# Altium project NBP12 Xilinx Spartan-IIE BGA456 Rev1.00.PrjPcb
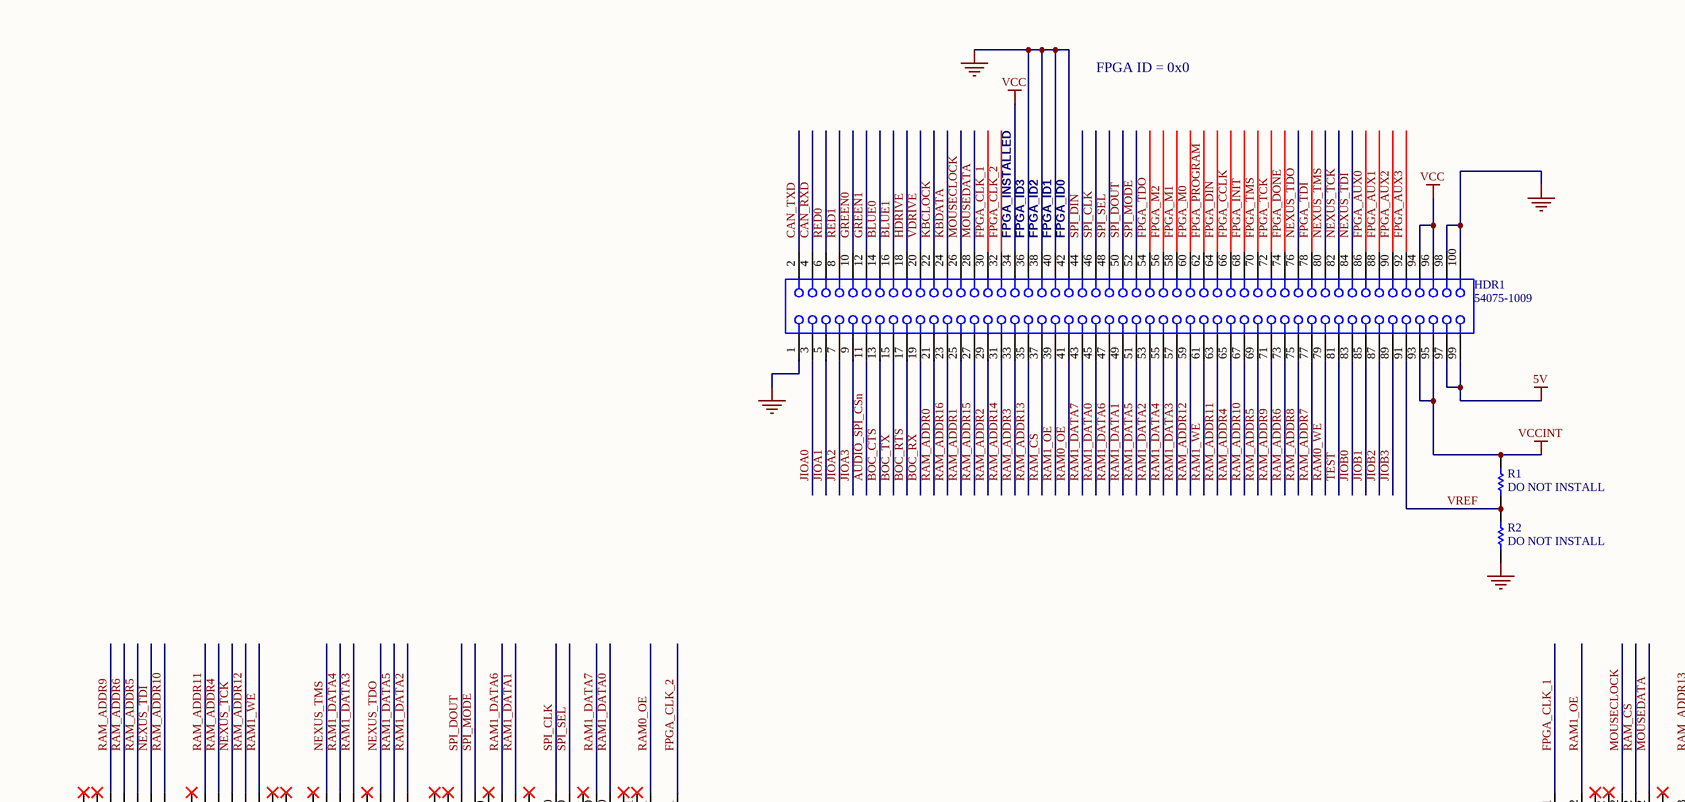
[diagram p0: NBP12 Xilinx Spartan-IIE BGA456 Rev1.00.SchDoc, top left]
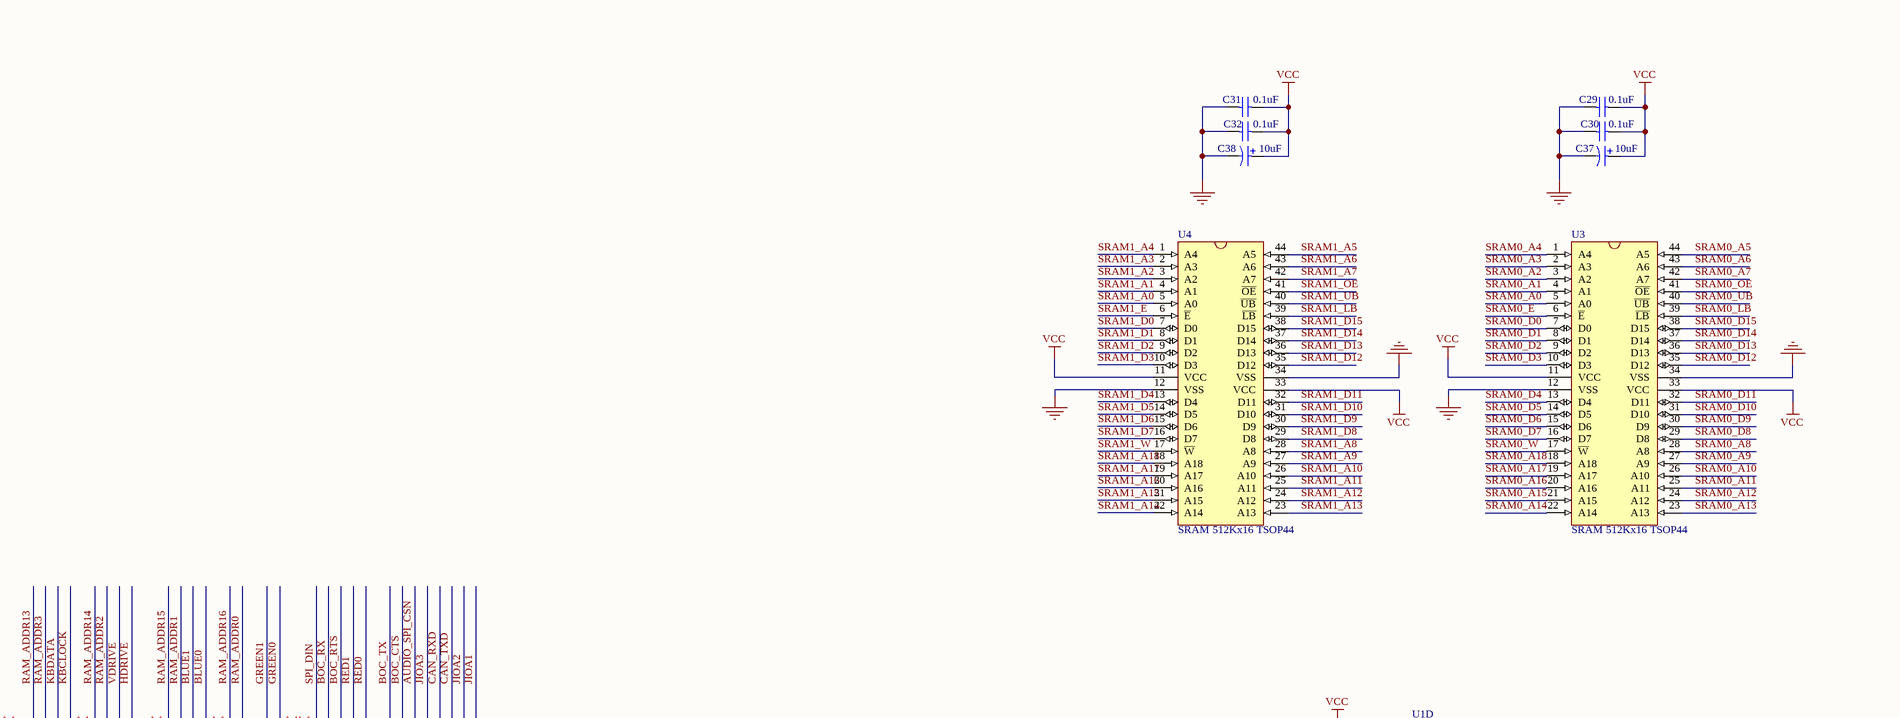
[diagram p1: NBP12 Xilinx Spartan-IIE BGA456 Rev1.00.SchDoc, top right]
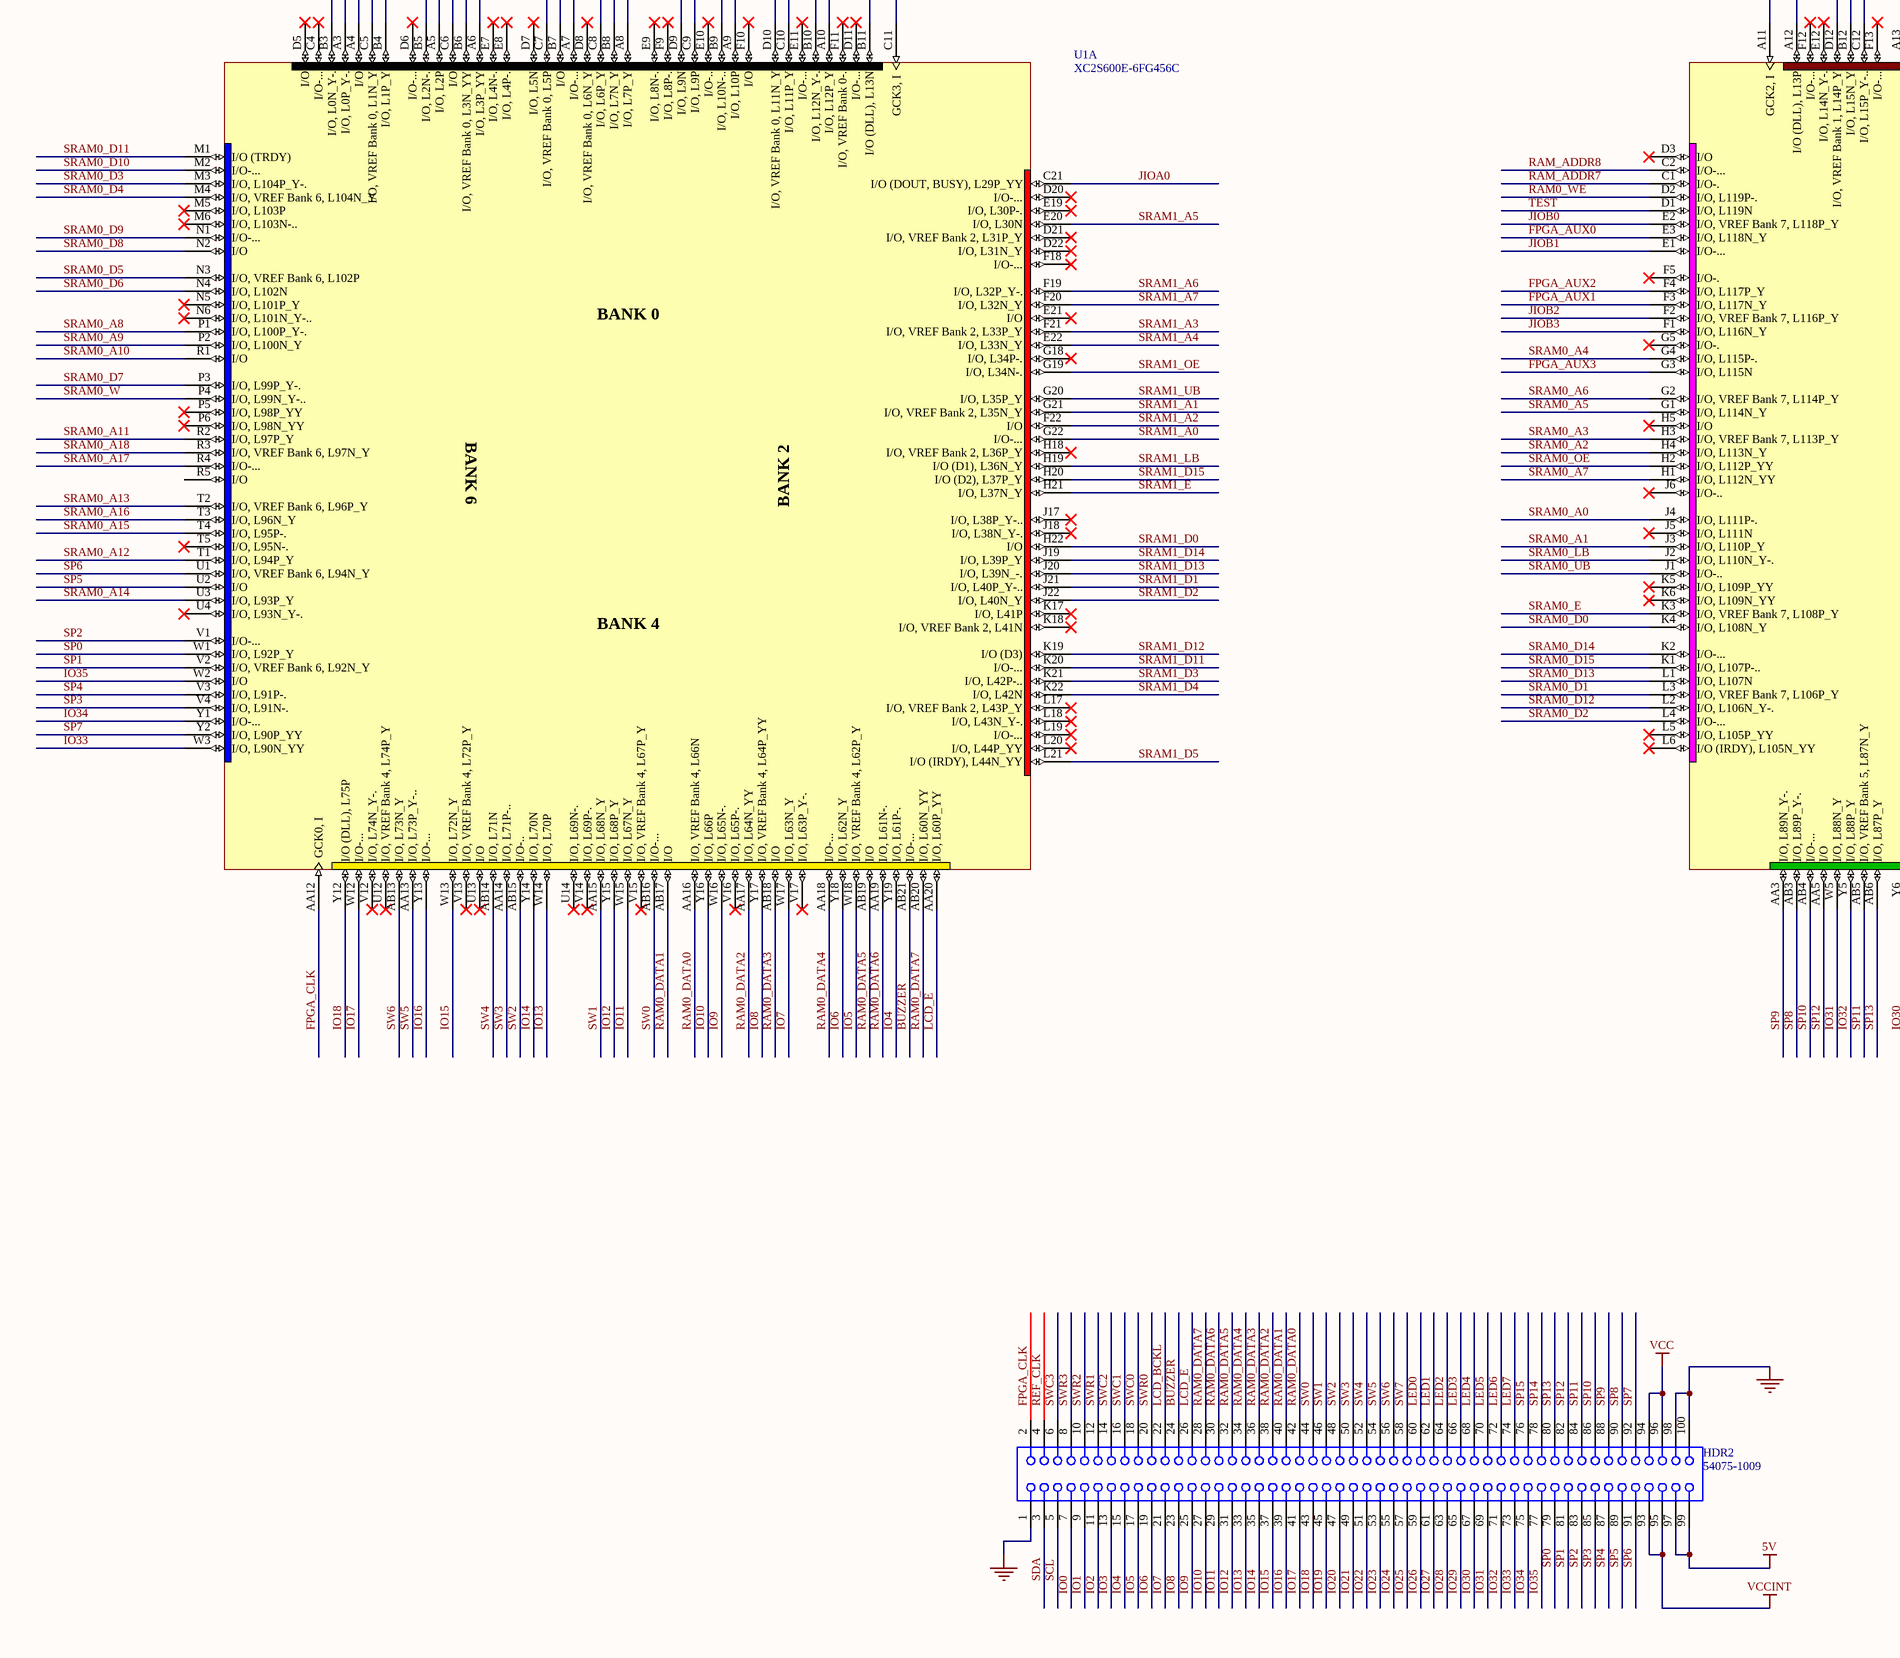
[diagram p2: NBP12 Xilinx Spartan-IIE BGA456 Rev1.00.SchDoc, bottom left]
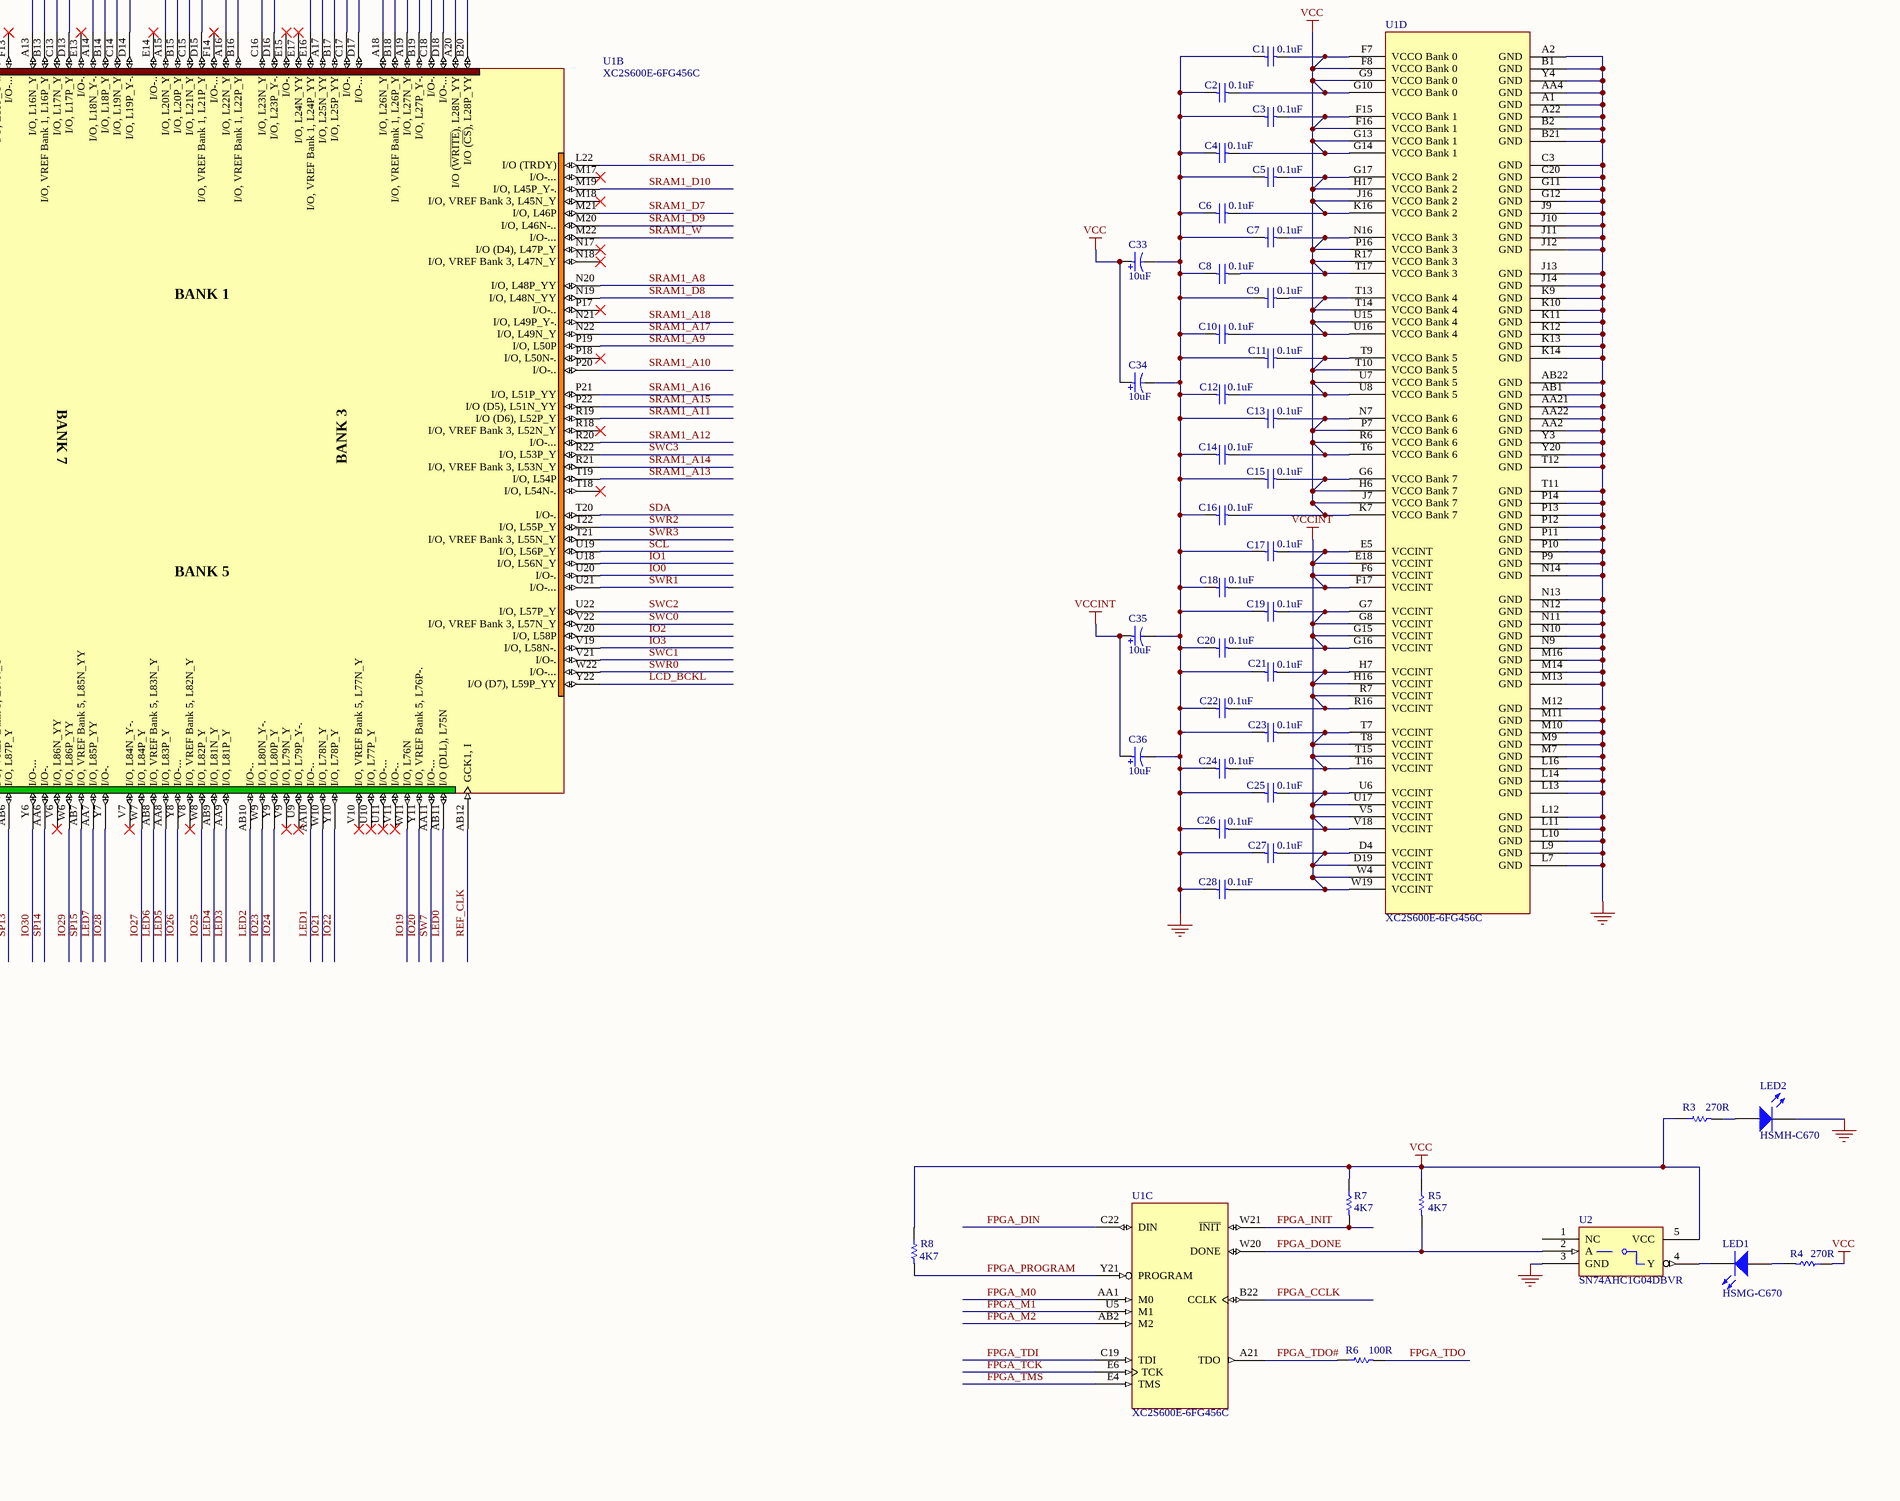
[diagram p3: NBP12 Xilinx Spartan-IIE BGA456 Rev1.00.SchDoc, bottom right]
1 sheet, 54 parts. Net scope: global (net labels, ports and power ports of the same name join across sheets).
Board file: NBP12 Xilinx Spartan-IIE BGA456 Rev1.00.PcbDoc

## Sheet NBP12 Xilinx Spartan-IIE BGA456 Rev1.00.SchDoc
size D; Organization: Altium Limited; Address1: L3, 12a Rodborough Rd; Address2: Frenchs Forest; Address3: NSW; Address4: Australia 2086; DocumentNumber: 1; SheetNumber: 1; SheetTotal: 1

### Parts
C1  0.1uF  [CC1608-0603]
C2  0.1uF  [CC1608-0603]
C3  0.1uF  [CC1608-0603]
C4  0.1uF  [CC1608-0603]
C5  0.1uF  [CC1608-0603]
C6  0.1uF  [CC1608-0603]
C7  0.1uF  [CC1608-0603]
C8  0.1uF  [CC1608-0603]
C9  0.1uF  [CC1608-0603]
C10  0.1uF  [CC1608-0603]
C11  0.1uF  [CC1608-0603]
C12  0.1uF  [CC1608-0603]
C13  0.1uF  [CC1608-0603]
C14  0.1uF  [CC1608-0603]
C15  0.1uF  [CC1608-0603]
C16  0.1uF  [CC1608-0603]
C17  0.1uF  [CC1608-0603]
C18  0.1uF  [CC1608-0603]
C19  0.1uF  [CC1608-0603]
C20  0.1uF  [CC1608-0603]
C21  0.1uF  [CC1608-0603]
C22  0.1uF  [CC1608-0603]
C23  0.1uF  [CC1608-0603]
C24  0.1uF  [CC1608-0603]
C25  0.1uF  [CC1608-0603]
C26  0.1uF  [CC1608-0603]
C27  0.1uF  [CC1608-0603]
C28  0.1uF  [CC1608-0603]
C29  0.1uF  [CC1608-0603]
C30  0.1uF  [CC1608-0603]
C31  0.1uF  [CC1608-0603]
C32  0.1uF  [CC1608-0603]
C33  10uF  [MCCT-B]
C34  10uF  [MCCT-B]
C35  10uF  [MCCT-B]
C36  10uF  [MCCT-B]
C37  10uF  [MCCT-B]
C38  10uF  [MCCT-B]
HDR1  54075-1009  [54075]
HDR2  54075-1009  [54075]
LED1  HSMG-C670  [SMD _LED]
LED2  HSMH-C670  [SMD _LED]
R1  DO NOT INSTALL  [CC2012-0805]
R2  DO NOT INSTALL  [CC2012-0805]
R3  270R  [CC2012-0805]
R4  270R  [CC2012-0805]
R5  4K7  [CC2012-0805]
R6  100R  [CC2012-0805]
R7  4K7  [CC2012-0805]
R8  4K7  [CC2012-0805]
U1  XC2S600E-6FG456C  [FG456]  (parts A,B,C,D of 4)
U2  SN74AHC1G04DBVR  [SO-G5/P.95]
U3  SRAM 512Kx16 TSOP44  [SO-G44/P.8]
U4  SRAM 512Kx16 TSOP44  [SO-G44/P.8]

### Nets
5V: HDR1.97 HDR1.99 HDR2.97 HDR2.99
GND: C1.1 C2.1 C3.1 C4.1 C5.1 C6.1 C7.1 C8.1 C9.1 C10.1 C11.1 C12.1 C13.1 C14.1 C15.1 C16.1 C17.1 C18.1 C19.1 C20.1 C21.1 C22.1 C23.1 C24.1 C25.1 C26.1 C27.1 C28.1 C29.1 C30.1 C31.1 C32.1 C33.2 C34.2 C35.2 C36.2 C37.2 C38.2 HDR1.1 HDR1.36 HDR1.38 HDR1.40 HDR1.42 HDR1.98 HDR1.100 HDR2.1 HDR2.98 HDR2.100 LED2.2(K) R2.2 U1.A1(GND) U1.A2(GND) U1.A22(GND) U1.AA2(GND) U1.AA4(GND) U1.AA21(GND) U1.AA22(GND) U1.AB1(GND) U1.AB22(GND) U1.B1(GND) U1.B2(GND) U1.B21(GND) U1.C3(GND) U1.C20(GND) U1.G11(GND) U1.G12(GND) U1.J9(GND) U1.J10(GND) U1.J11(GND) U1.J12(GND) U1.J13(GND) U1.J14(GND) U1.K9(GND) U1.K10(GND) U1.K11(GND) U1.K12(GND) U1.K13(GND) U1.K14(GND) U1.L7(GND) U1.L9(GND) U1.L10(GND) U1.L11(GND) U1.L12(GND) U1.L13(GND) U1.L14(GND) U1.L16(GND) U1.M7(GND) U1.M9(GND) U1.M10(GND) U1.M11(GND) U1.M12(GND) U1.M13(GND) U1.M14(GND) U1.M16(GND) U1.N9(GND) U1.N10(GND) U1.N11(GND) U1.N12(GND) U1.N13(GND) U1.N14(GND) U1.P9(GND) U1.P10(GND) U1.P11(GND) U1.P12(GND) U1.P13(GND) U1.P14(GND) U1.T11(GND) U1.T12(GND) U1.Y3(GND) U1.Y4(GND) U1.Y20(GND) U2.3(GND) U3.12(VSS) U3.34(VSS) U4.12(VSS) U4.34(VSS)
VCC: C1.2 C2.2 C3.2 C4.2 C5.2 C6.2 C7.2 C8.2 C9.2 C10.2 C11.2 C12.2 C13.2 C14.2 C15.2 C16.2 C29.2 C30.2 C31.2 C32.2 C33.1 C34.1 C37.1 C38.1 HDR1.34 HDR1.94 HDR1.96 HDR2.94 HDR2.96 R3.1 R4.1 R5.1 R7.1 R8.1 U1.F7(VCCO_Bank_0) U1.F8(VCCO_Bank_0) U1.F15(VCCO_Bank_1) U1.F16(VCCO_Bank_1) U1.G6(VCCO_Bank_7) U1.G9(VCCO_Bank_0) U1.G10(VCCO_Bank_0) U1.G13(VCCO_Bank_1) U1.G14(VCCO_Bank_1) U1.G17(VCCO_Bank_2) U1.H6(VCCO_Bank_7) U1.H17(VCCO_Bank_2) U1.J7(VCCO_Bank_7) U1.J16(VCCO_Bank_2) U1.K7(VCCO_Bank_7) U1.K16(VCCO_Bank_2) U1.N7(VCCO_Bank_6) U1.N16(VCCO_Bank_3) U1.P7(VCCO_Bank_6) U1.P16(VCCO_Bank_3) U1.R6(VCCO_Bank_6) U1.R17(VCCO_Bank_3) U1.T6(VCCO_Bank_6) U1.T9(VCCO_Bank_5) U1.T10(VCCO_Bank_5) U1.T13(VCCO_Bank_4) U1.T14(VCCO_Bank_4) U1.T17(VCCO_Bank_3) U1.U7(VCCO_Bank_5) U1.U8(VCCO_Bank_5) U1.U15(VCCO_Bank_4) U1.U16(VCCO_Bank_4) U2.5(VCC) U3.11(VCC) U3.33(VCC) U4.11(VCC) U4.33(VCC)
VCCINT: C17.2 C18.2 C19.2 C20.2 C21.2 C22.2 C23.2 C24.2 C25.2 C26.2 C27.2 C28.2 C35.1 C36.1 HDR1.93 HDR1.95 HDR2.93 HDR2.95 R1.1 U1.D4(VCCINT) U1.D19(VCCINT) U1.E5(VCCINT) U1.E18(VCCINT) U1.F6(VCCINT) U1.F17(VCCINT) U1.G7(VCCINT) U1.G8(VCCINT) U1.G15(VCCINT) U1.G16(VCCINT) U1.H7(VCCINT) U1.H16(VCCINT) U1.R7(VCCINT) U1.R16(VCCINT) U1.T7(VCCINT) U1.T8(VCCINT) U1.T15(VCCINT) U1.T16(VCCINT) U1.U6(VCCINT) U1.U17(VCCINT) U1.V5(VCCINT) U1.V18(VCCINT) U1.W4(VCCINT) U1.W19(VCCINT)
AUDIO_SPI_CSn: HDR1.11 U1.A19(I/O,_L27N_Y)
BLUE0: HDR1.14 U1.D15(I/O,_VREF_Bank_1,_L21P_Y)
BLUE1: HDR1.16 U1.C15(I/O,_L21N_Y)
BOC_CTS: HDR1.13 U1.B18(I/O,_VREF_Bank_1,_L26P_Y)
BOC_RTS: HDR1.17 U1.B17(I/O,_L25P_YY)
BOC_RX: HDR1.19 U1.A17(I/O,_L25N_YY)
BOC_TX: HDR1.15 U1.A18(I/O,_L26N_Y)
BUZZER: HDR2.24 U1.AB21(I/O-...)
CAN_RXD: HDR1.4 U1.C18(I/O-.)
CAN_TXD: HDR1.2 U1.D18(I/O-...)
FPGA_AUX0: HDR1.86 U1.E3(I/O,_L118N_Y)
FPGA_AUX1: HDR1.88 U1.F3(I/O,_L117N_Y)
FPGA_AUX2: HDR1.90 U1.F4(I/O,_L117P_Y)
FPGA_AUX3: HDR1.92 U1.G3(I/O,_L115N)
FPGA_CCLK: HDR1.66 U1.B22(CCLK)
FPGA_CLK: HDR2.2 U1.AA12(GCK0,_I)
FPGA_CLK_1: HDR1.30 U1.A11(GCK2,_I)
FPGA_CLK_2: HDR1.32 U1.C11(GCK3,_I)
FPGA_DIN: HDR1.64 U1.C22(DIN)
FPGA_DONE: HDR1.74 R5.2 U1.W20(DONE) U2.2(A)
FPGA_INIT: HDR1.68 R7.2 U1.W21(~{INIT})
FPGA_M0: HDR1.60 U1.AA1(M0)
FPGA_M1: HDR1.58 U1.U5(M1)
FPGA_M2: HDR1.56 U1.AB2(M2)
FPGA_PROGRAM: HDR1.62 R8.2 U1.Y21(PROGRAM)
FPGA_TCK: HDR1.72 U1.E6(TCK)
FPGA_TDI: HDR1.78 U1.C19(TDI)
FPGA_TDO: HDR1.54 R6.2
FPGA_TDO#: R6.1 U1.A21(TDO)
FPGA_TMS: HDR1.70 U1.E4(TMS)
GREEN0: HDR1.10 U1.D16(I/O,_L23P_Y-.)
GREEN1: HDR1.12 U1.C16(I/O,_L23N_Y)
HDRIVE: HDR1.18 U1.D14(I/O,_L19P_Y-.)
IO0: HDR2.7 U1.U20(I/O-.)
IO1: HDR2.9 U1.U18(I/O,_L56N_Y)
IO2: HDR2.11 U1.V20(I/O,_L58P)
IO3: HDR2.13 U1.V19(I/O,_L58N-.)
IO4: HDR2.15 U1.Y19(I/O,_L61P-.)
IO5: HDR2.17 U1.W18(I/O,_VREF_Bank_4,_L62P_Y)
IO6: HDR2.19 U1.Y18(I/O,_L62N_Y)
IO7: HDR2.21 U1.W17(I/O,_L63N_Y)
IO8: HDR2.23 U1.Y17(I/O,_VREF_Bank_4,_L64P_YY)
IO9: HDR2.25 U1.W16(I/O,_L65N-.)
IO10: HDR2.27 U1.Y16(I/O,_L66P)
IO11: HDR2.29 U1.W15(I/O,_L67N_Y)
IO12: HDR2.31 U1.Y15(I/O,_L68P_Y)
IO13: HDR2.33 U1.W14(I/O,_L70P)
IO14: HDR2.35 U1.Y14(I/O,_L70N)
IO15: HDR2.37 U1.W13(I/O,_L72N_Y)
IO16: HDR2.39 U1.Y13(I/O-...)
IO17: HDR2.41 U1.W12(I/O-...)
IO18: HDR2.43 U1.Y12(I/O_(DLL),_L75P)
IO19: HDR2.45 U1.W11(I/O,_L76N)
IO20: HDR2.47 U1.Y11(I/O,_VREF_Bank_5,_L76P-.)
IO21: HDR2.49 U1.W10(I/O,_L78N_Y)
IO22: HDR2.51 U1.Y10(I/O,_L78P_Y)
IO23: HDR2.53 U1.W9(I/O,_L80N_Y-.)
IO24: HDR2.55 U1.Y9(I/O,_L80P_Y)
IO25: HDR2.57 U1.W8(I/O,_L82P_Y)
IO26: HDR2.59 U1.Y8(I/O-...)
IO27: HDR2.61 U1.W7(I/O,_L84P_Y)
IO28: HDR2.63 U1.Y7(I/O-.)
IO29: HDR2.65 U1.W6(I/O,_L86P_YY)
IO30: HDR2.67 U1.Y6(I/O-...)
IO31: HDR2.69 U1.W5(I/O,_L88N_Y)
IO32: HDR2.71 U1.Y5(I/O,_L88P_Y)
IO33: HDR2.73 U1.W3(I/O,_L90N_YY)
IO34: HDR2.75 U1.Y1(I/O-...)
IO35: HDR2.77 U1.W2(I/O)
JIOA0: HDR1.3 U1.C21(I/O_(DOUT,_BUSY),_L29P_YY)
JIOA1: HDR1.5 U1.B20(I/O_(~{CS}),_L28P_YY)
JIOA2: HDR1.7 U1.A20(I/O_(~{WRITE}),_L28N_YY)
JIOA3: HDR1.9 U1.B19(I/O,_L27P_Y-.)
JIOB0: HDR1.83 U1.E2(I/O,_VREF_Bank_7,_L118P_Y)
JIOB1: HDR1.85 U1.E1(I/O-...)
JIOB2: HDR1.87 U1.F2(I/O,_VREF_Bank_7,_L116P_Y)
JIOB3: HDR1.89 U1.F1(I/O,_L116N_Y)
KBCLOCK: HDR1.22 U1.D13(I/O,_L17P_Y)
KBDATA: HDR1.24 U1.C13(I/O,_L17N_Y)
LCD_BCKL: HDR2.22 U1.Y22(I/O_(D7),_L59P_YY)
LCD_E: HDR2.26 U1.AA20(I/O,_L60P_YY)
LED0: HDR2.60 U1.AB11(I/O_(DLL),_L75N)
LED1: HDR2.62 U1.AA10(I/O-..)
LED2: HDR2.64 U1.AB10(I/O-..)
LED3: HDR2.66 U1.AA9(I/O,_L81P_Y)
LED4: HDR2.68 U1.AB9(I/O,_L81N_Y)
LED5: HDR2.70 U1.AA8(I/O,_L83P_Y)
LED6: HDR2.72 U1.AB8(I/O,_VREF_Bank_5,_L83N_Y)
LED7: HDR2.74 U1.AA7(I/O,_L85P_YY)
MOUSECLOCK: HDR1.26 U1.D12(I/O,_VREF_Bank_1,_L14P_Y)
MOUSEDATA: HDR1.28 U1.C12(I/O,_L15P_Y-..)
NEXUS_TCK: HDR1.82 U1.C6(I/O)
NEXUS_TDI: HDR1.84 U1.C5(I/O,_VREF_Bank_0,_L1N_Y)
NEXUS_TDO: HDR1.76 U1.C8(I/O,_L6P_Y)
NEXUS_TMS: HDR1.80 U1.C7(I/O,_VREF_Bank_0,_L5P)
RAM0_DATA0: HDR2.42 U1.AA16(I/O,_VREF_Bank_4,_L66N)
RAM0_DATA1: HDR2.40 U1.AB17(I/O)
RAM0_DATA2: HDR2.38 U1.AA17(I/O,_L64N_YY)
RAM0_DATA3: HDR2.36 U1.AB18(I/O)
RAM0_DATA4: HDR2.34 U1.AA18(I/O-...)
RAM0_DATA5: HDR2.32 U1.AB19(I/O)
RAM0_DATA6: HDR2.30 U1.AA19(I/O,_L61N-.)
RAM0_DATA7: HDR2.28 U1.AB20(I/O,_L60N_YY)
RAM0_OE: HDR1.41 U1.B11(I/O_(DLL),_L13N)
RAM0_WE: HDR1.79 U1.D2(I/O,_L119P-.)
RAM1_DATA0: HDR1.45 U1.A10(I/O,_L12P_Y)
RAM1_DATA1: HDR1.49 U1.A9(I/O,_L10P)
RAM1_DATA2: HDR1.53 U1.A8(I/O,_L7P_Y)
RAM1_DATA3: HDR1.57 U1.A7(I/O-...)
RAM1_DATA4: HDR1.55 U1.B7(I/O)
RAM1_DATA5: HDR1.51 U1.B8(I/O,_L7N_Y)
RAM1_DATA6: HDR1.47 U1.B9(I/O,_L10N-..)
RAM1_DATA7: HDR1.43 U1.B10(I/O,_L12N_Y-.)
RAM1_OE: HDR1.39 U1.A12(I/O_(DLL),_L13P)
RAM1_WE: HDR1.61 U1.A6(I/O,_L3P_YY)
RAM_ADDR0: HDR1.21 U1.B16(I/O,_VREF_Bank_1,_L22P_Y)
RAM_ADDR1: HDR1.25 U1.B15(I/O,_L20P_Y)
RAM_ADDR2: HDR1.29 U1.B14(I/O,_L18P_Y)
RAM_ADDR3: HDR1.33 U1.B13(I/O,_VREF_Bank_1,_L16P_Y)
RAM_ADDR4: HDR1.65 U1.A5(I/O,_L2P)
RAM_ADDR5: HDR1.69 U1.A4(I/O)
RAM_ADDR6: HDR1.73 U1.A3(I/O,_L0P_Y-.)
RAM_ADDR7: HDR1.77 U1.C1(I/O-.)
RAM_ADDR8: HDR1.75 U1.C2(I/O-...)
RAM_ADDR9: HDR1.71 U1.B3(I/O,_L0N_Y-.)
RAM_ADDR10: HDR1.67 U1.B4(I/O,_L1P_Y)
RAM_ADDR11: HDR1.63 U1.B5(I/O,_L2N-.)
RAM_ADDR12: HDR1.59 U1.B6(I/O,_VREF_Bank_0,_L3N_YY)
RAM_ADDR13: HDR1.35 U1.A13(I/O,_L16N_Y)
RAM_ADDR14: HDR1.31 U1.A14(I/O,_L18N_Y-.)
RAM_ADDR15: HDR1.27 U1.A15(I/O,_L20N_Y)
RAM_ADDR16: HDR1.23 U1.A16(I/O,_L22N_Y)
RAM_CS: HDR1.37 U1.B12(I/O,_L15N_Y)
RED0: HDR1.6 U1.D17(I/O-...)
RED1: HDR1.8 U1.C17(I/O-.)
REF_CLK: HDR2.4 U1.AB12(GCK1,_I)
SCL: HDR2.5 U1.U19(I/O,_L56P_Y)
SDA: HDR2.3 U1.T20(I/O-.)
SP0: HDR2.79 U1.W1(I/O,_L92P_Y)
SP1: HDR2.81 U1.V2(I/O,_VREF_Bank_6,_L92N_Y)
SP2: HDR2.83 U1.V1(I/O-...)
SP3: HDR2.85 U1.V4(I/O,_L91N-.)
SP4: HDR2.87 U1.V3(I/O,_L91P-.)
SP5: HDR2.89 U1.U2(I/O)
SP6: HDR2.91 U1.U1(I/O,_VREF_Bank_6,_L94N_Y)
SP7: HDR2.92 U1.Y2(I/O,_L90P_YY)
SP8: HDR2.90 U1.AB3(I/O,_L89P_Y-.)
SP9: HDR2.88 U1.AA3(I/O,_L89N_Y-.)
SP10: HDR2.86 U1.AB4(I/O-...)
SP11: HDR2.84 U1.AB5(I/O,_VREF_Bank_5,_L87N_Y)
SP12: HDR2.82 U1.AA5(I/O)
SP13: HDR2.80 U1.AB6(I/O,_L87P_Y)
SP14: HDR2.78 U1.AA6(I/O-.)
SP15: HDR2.76 U1.AB7(I/O,_VREF_Bank_5,_L85N_YY)
SPI_CLK: HDR1.46 U1.D10(I/O,_VREF_Bank_0,_L11N_Y)
SPI_DIN: HDR1.44 U1.E16(I/O,_VREF_Bank_1,_L24P_YY)
SPI_DOUT: HDR1.50 U1.D9(I/O,_L9N)
SPI_MODE: HDR1.52 U1.C9(I/O,_L9P)
SPI_SEL: HDR1.48 U1.C10(I/O,_L11P_Y)
SRAM0_A0: U1.J4(I/O,_L111P-.) U3.5(A0)
SRAM0_A1: U1.J3(I/O,_L110P_Y) U3.4(A1)
SRAM0_A2: U1.H4(I/O,_L113N_Y) U3.3(A2)
SRAM0_A3: U1.H3(I/O,_VREF_Bank_7,_L113P_Y) U3.2(A3)
SRAM0_A4: U1.G4(I/O,_L115P-.) U3.1(A4)
SRAM0_A5: U1.G1(I/O,_L114N_Y) U3.44(A5)
SRAM0_A6: U1.G2(I/O,_VREF_Bank_7,_L114P_Y) U3.43(A6)
SRAM0_A7: U1.H1(I/O,_L112N_YY) U3.42(A7)
SRAM0_A8: U1.P1(I/O,_L100P_Y-.) U3.28(A8)
SRAM0_A9: U1.P2(I/O,_L100N_Y) U3.27(A9)
SRAM0_A10: U1.R1(I/O) U3.26(A10)
SRAM0_A11: U1.R2(I/O,_L97P_Y) U3.25(A11)
SRAM0_A12: U1.T1(I/O,_L94P_Y) U3.24(A12)
SRAM0_A13: U1.T2(I/O,_VREF_Bank_6,_L96P_Y) U3.23(A13)
SRAM0_A14: U1.U3(I/O,_L93P_Y) U3.22(A14)
SRAM0_A15: U1.T4(I/O,_L95P-.) U3.21(A15)
SRAM0_A16: U1.T3(I/O,_L96N_Y) U3.20(A16)
SRAM0_A17: U1.R4(I/O-...) U3.19(A17)
SRAM0_A18: U1.R3(I/O,_VREF_Bank_6,_L97N_Y) U3.18(A18)
SRAM0_D0: U1.K4(I/O,_L108N_Y) U3.7(D0)
SRAM0_D1: U1.L3(I/O,_VREF_Bank_7,_L106P_Y) U3.8(D1)
SRAM0_D2: U1.L4(I/O-...) U3.9(D2)
SRAM0_D3: U1.M3(I/O,_L104P_Y-.) U3.10(D3)
SRAM0_D4: U1.M4(I/O,_VREF_Bank_6,_L104N_Y) U3.13(D4)
SRAM0_D5: U1.N3(I/O,_VREF_Bank_6,_L102P) U3.14(D5)
SRAM0_D6: U1.N4(I/O,_L102N) U3.15(D6)
SRAM0_D7: U1.P3(I/O,_L99P_Y-.) U3.16(D7)
SRAM0_D8: U1.N2(I/O) U3.29(D8)
SRAM0_D9: U1.N1(I/O-...) U3.30(D9)
SRAM0_D10: U1.M2(I/O-...) U3.31(D10)
SRAM0_D11: U1.M1(I/O_(TRDY)) U3.32(D11)
SRAM0_D12: U1.L2(I/O,_L106N_Y-.) U3.35(D12)
SRAM0_D13: U1.L1(I/O,_L107N) U3.36(D13)
SRAM0_D14: U1.K2(I/O-...) U3.37(D14)
SRAM0_D15: U1.K1(I/O,_L107P-..) U3.38(D15)
SRAM0_E: U1.K3(I/O,_VREF_Bank_7,_L108P_Y) U3.6(~{E})
SRAM0_LB: U1.J2(I/O,_L110N_Y-.) U3.39(~{LB})
SRAM0_OE: U1.H2(I/O,_L112P_YY) U3.41(~{OE})
SRAM0_UB: U1.J1(I/O-..) U3.40(~{UB})
SRAM0_W: U1.P4(I/O,_L99N_Y-..) U3.17(~{W})
SRAM1_A0: U1.G22(I/O-...) U4.5(A0)
SRAM1_A1: U1.G21(I/O,_VREF_Bank_2,_L35N_Y) U4.4(A1)
SRAM1_A2: U1.F22(I/O) U4.3(A2)
SRAM1_A3: U1.F21(I/O,_VREF_Bank_2,_L33P_Y) U4.2(A3)
SRAM1_A4: U1.E22(I/O,_L33N_Y) U4.1(A4)
SRAM1_A5: U1.E20(I/O,_L30N) U4.44(A5)
SRAM1_A6: U1.F19(I/O,_L32P_Y-.) U4.43(A6)
SRAM1_A7: U1.F20(I/O,_L32N_Y) U4.42(A7)
SRAM1_A8: U1.N20(I/O,_L48P_YY) U4.28(A8)
SRAM1_A9: U1.P19(I/O,_L50P) U4.27(A9)
SRAM1_A10: U1.P20(I/O-..) U4.26(A10)
SRAM1_A11: U1.R19(I/O_(D6),_L52P_Y) U4.25(A11)
SRAM1_A12: U1.R20(I/O-...) U4.24(A12)
SRAM1_A13: U1.T19(I/O,_L54P) U4.23(A13)
SRAM1_A14: U1.R21(I/O,_VREF_Bank_3,_L53N_Y) U4.22(A14)
SRAM1_A15: U1.P22(I/O_(D5),_L51N_YY) U4.21(A15)
SRAM1_A16: U1.P21(I/O,_L51P_YY) U4.20(A16)
SRAM1_A17: U1.N22(I/O,_L49N_Y) U4.19(A17)
SRAM1_A18: U1.N21(I/O,_L49P_Y-.) U4.18(A18)
SRAM1_D0: U1.H22(I/O) U4.7(D0)
SRAM1_D1: U1.J21(I/O,_L40P_Y-..) U4.8(D1)
SRAM1_D2: U1.J22(I/O,_L40N_Y) U4.9(D2)
SRAM1_D3: U1.K21(I/O,_L42P-..) U4.10(D3)
SRAM1_D4: U1.K22(I/O,_L42N) U4.13(D4)
SRAM1_D5: U1.L21(I/O_(IRDY),_L44N_YY) U4.14(D5)
SRAM1_D6: U1.L22(I/O_(TRDY)) U4.15(D6)
SRAM1_D7: U1.M21(I/O,_L46P) U4.16(D7)
SRAM1_D8: U1.N19(I/O,_L48N_YY) U4.29(D8)
SRAM1_D9: U1.M20(I/O,_L46N-..) U4.30(D9)
SRAM1_D10: U1.M19(I/O,_L45P_Y-.) U4.31(D10)
SRAM1_D11: U1.K20(I/O-...) U4.32(D11)
SRAM1_D12: U1.K19(I/O_(D3)) U4.35(D12)
SRAM1_D13: U1.J20(I/O,_L39N_-.) U4.36(D13)
SRAM1_D14: U1.J19(I/O,_L39P_Y) U4.37(D14)
SRAM1_D15: U1.H20(I/O_(D2),_L37P_Y) U4.38(D15)
SRAM1_E: U1.H21(I/O,_L37N_Y) U4.6(~{E})
SRAM1_LB: U1.H19(I/O_(D1),_L36N_Y) U4.39(~{LB})
SRAM1_OE: U1.G19(I/O,_L34N-.) U4.41(~{OE})
SRAM1_UB: U1.G20(I/O,_L35P_Y) U4.40(~{UB})
SRAM1_W: U1.M22(I/O-...) U4.17(~{W})
SW0: HDR2.44 U1.AB16(I/O-...)
SW1: HDR2.46 U1.AA15(I/O,_L68N_Y)
SW2: HDR2.48 U1.AB15(I/O-..)
SW3: HDR2.50 U1.AA14(I/O,_L71P-..)
SW4: HDR2.52 U1.AB14(I/O,_L71N)
SW5: HDR2.54 U1.AA13(I/O,_L73P_Y-..)
SW6: HDR2.56 U1.AB13(I/O,_L73N_Y)
SW7: HDR2.58 U1.AA11(I/O-...)
SWC0: HDR2.18 U1.V22(I/O,_VREF_Bank_3,_L57N_Y)
SWC1: HDR2.16 U1.V21(I/O-.)
SWC2: HDR2.14 U1.U22(I/O,_L57P_Y)
SWC3: HDR2.6 U1.R22(I/O,_L53P_Y)
SWR0: HDR2.20 U1.W22(I/O-...)
SWR1: HDR2.12 U1.U21(I/O-...)
SWR2: HDR2.10 U1.T22(I/O,_L55P_Y)
SWR3: HDR2.8 U1.T21(I/O,_VREF_Bank_3,_L55N_Y)
TEST: HDR1.81 U1.D1(I/O,_L119N)
VDRIVE: HDR1.20 U1.C14(I/O,_L19N_Y)
VREF: HDR1.91 R1.2 R2.1
NetLED1_1: LED1.1(A) R4.2
NetLED1_2: LED1.2(K) U2.4(Y)
NetLED2_1: LED2.1(A) R3.2

Not connected (* = marked no-connect by the designer): U1 C4(I/O-...)* D3(I/O)* D5(I/O)* D6(I/O-...)* D7(I/O,_L5N)* D8(I/O,_VREF_Bank_0,_L6N_Y)* D11(I/O-...)* D20(I/O-...)* D21(I/O,_VREF_Bank_2,_L31P_Y)* D22(I/O,_L31N_Y)* E7(I/O,_L4N-.)* E8(I/O,_L4P-.)* E9(I/O,_L8N-.)* E10(I/O-..)* E11(I/O-...)* E12(I/O,_L14N_Y-.)* E13(I/O-.)* E14(I/O-..)* E15(I/O-.)* E17(I/O,_L24N_YY)* E19(I/O,_L30P-.)* E21(I/O)* F5(I/O-.)* F9(I/O,_L8P-.)* F10(I/O)* F11(I/O,_VREF_Bank_0-.)* F12(I/O-...)* F13(I/O-...)* F14(I/O-...)* F18(I/O-...)* G5(I/O-.)* G18(I/O,_L34P-.)* H5(I/O)* H18(I/O,_VREF_Bank_2,_L36P_Y)* J5(I/O,_L111N)* J6(I/O-..)* J17(I/O,_L38P_Y-..)* J18(I/O,_L38N_Y-.)* K5(I/O,_L109P_YY)* K6(I/O,_L109N_YY)* K17(I/O,_L41P)* K18(I/O,_VREF_Bank_2,_L41N)* L5(I/O,_L105P_YY)* L6(I/O_(IRDY),_L105N_YY)* L17(I/O,_VREF_Bank_2,_L43P_Y)* L18(I/O,_L43N_Y-.)* L19(I/O-...)* L20(I/O,_L44P_YY)* M5(I/O,_L103P)* M6(I/O,_L103N-..)* M17(I/O-...)* M18(I/O,_VREF_Bank_3,_L45N_Y)* N5(I/O,_L101P_Y)* N6(I/O,_L101N_Y-..)* N17(I/O_(D4),_L47P_Y)* N18(I/O,_VREF_Bank_3,_L47N_Y)* P5(I/O,_L98P_YY)* P6(I/O,_L98N_YY)* P17(I/O-..)* P18(I/O,_L50N-.)* R5(I/O) R18(I/O,_VREF_Bank_3,_L52N_Y)* T5(I/O,_L95N-.)* T18(I/O,_L54N-.)* U4(I/O,_L93N_Y-.)* U9(I/O,_L79P_Y-.)* U10(I/O,_L77P_Y)* U11(I/O-...)* U12(I/O,_VREF_Bank_4,_L74P_Y)* U13(I/O)* U14(I/O,_L69N-.)* V6(I/O,_L86N_YY)* V7(I/O,_L84N_Y-.)* V8(I/O,_VREF_Bank_5,_L82N_Y)* V9(I/O,_L79N_Y)* V10(I/O,_VREF_Bank_5,_L77N_Y)* V11(I/O-..)* V12(I/O,_L74N_Y-.)* V13(I/O,_VREF_Bank_4,_L72P_Y)* V14(I/O,_L69P-.)* V15(I/O,_VREF_Bank_4,_L67P_Y)* V16(I/O,_L65P-.)* V17(I/O,_L63P_Y-.)*; U2 1(NC)

### Notes on the sheet
- FPGA ID = 0x0
- (near HDR1) FPGA_INSTALLED
- (near HDR1) FPGA_ID3
- (near HDR1) FPGA_ID2
- (near HDR1) FPGA_ID1
- (near HDR1) FPGA_ID0
- Title
- Size:
- Date:
- File:
- D
- Number:
- Time:
- Revision:
- Sheet
- of
- (in symbol XC2S600E-6FG456C, part A) BANK 0; BANK 6; BANK 2; BANK 4
- (in symbol XC2S600E-6FG456C, part B) BANK 1; BANK 7; BANK 3; BANK 5

### Library data of the parts
C1-C32 = CAP: Capacitor
C33-C38 = CAP_POLAR: Polar Capacitor
HDR1 HDR2 = 54075-1009: Board-to-Board, Docking Station, 0.80mm (.031") Pitch, Shielded Receptacle, Vertical, Ultra Low Profile, SMT; Manufacturer: Molex; Package Information: Latest Revision: Jun-2001; Mating Height: 8.5mm; Voltage: 100V; Current: 0.5A; Contact Resistance: 40mOhm max; PCB Layout: Complies with Manufacturer's Recommendation.; Published: 15-Oct-2003; Datasheet: Latest Revision: Feb-2002; Package Reference: 54075; Publisher: Altium Limited
LED1 = HSMX-C670: GREEN AS AlGaAs SMD LED; Manufacturer: Agilent; Published: 5-Jan-2004; Datasheet: Latest Revision: 30-Apr-2002; Publisher: Altium Limited
LED2 = HSMX-C670: RED AS AlGaAs SMD LED; Manufacturer: Agilent; Published: 5-Jan-2004; Datasheet: Latest Revision: 30-Apr-2002; Publisher: Altium Limited
R1-R8 = RES: Resistor; Manufacturer: Phycomp; Published: 5-Jan-2004; Datasheet: Latest Revision: Nov-2002; Publisher: Altium Limited
U1 = XC2S600E-6FG456C: Spartan-IIE 1.8V FPGA, 456-Ball FBGA, Standard Performance, Commercial Grade; Package Information: Latest Revision: ver1.1, Apr-2001; Code - JEDEC: MO-151-AAJ-1; Published: 17-Jan-2003; Datasheet: Latest Revision: 09-Jul-2003; Package Reference: FG456; Publisher: Altium Limited
U2 = SN74AHC1G04DBVR: Single Gate Inverter; Manufacturer: Texas Instruments; Published: 5-Jan-2004; Datasheet: Latest Revision: Sep-2003; Publisher: Altium Limited
U3 U4 = SRAM 512Kx16 TSOP44: 512Kx16Bit SRAM TSOP44